# EAGLE schematic untitled (EAGLE 6.3)
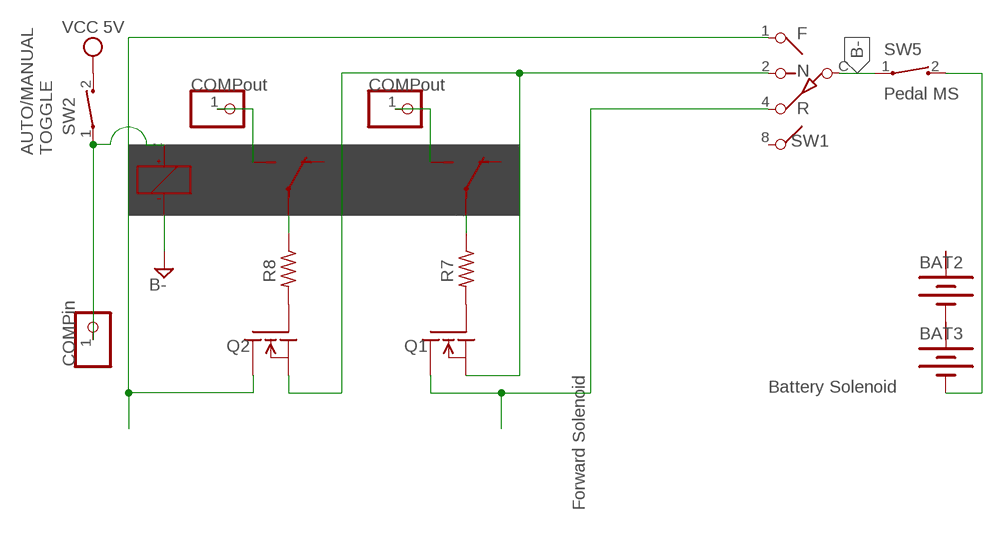
[diagram p0: schematic, sheet 1]

## Parts
BAT2  BATTERY  [BATTERY]
BAT3  BATTERY  [BATTERY]
JP4  COMPout  PINHD-1X1  [1X01]
JP6  COMPin  PINHD-1X1  [1X01]
JP22  COMPout  PINHD-1X1  [1X01]
K2  DF2-L-DC24V  [DF2]
Q1  BUZ11  [TO220]
Q2  BUZ11  [TO220]
R7  R-US_0204/5  [0204/5]
R8  R-US_0204/5  [0204/5]
SW1  SW-C10  [SW-C10]
SW2  Pedal MS  CT10-XXXX-A2  [CT10-XXXX-A2]
SW5  Pedal MS  CT10-XXXX-A2  [CT10-XXXX-A2]

## Nets
B-: BAT3.- Q1.3(S) Q2.3(S) SW1.2 SW5.2
FGND: Q1.2(D) SW1.4
GND1: K2.1(1:-) ; supply symbol labelled B-
N$1: JP4.1 K2.6(2:S)
N$2: JP22.1 K2.7(3:S)
N$7: BAT2.- BAT3.+
N$10: K2.10(3:P) R7.1
N$11: Q2.1(G) R8.2
N$12: Q1.1(G) R7.2
N$13: K2.3(2:P) R8.1
N$23: JP6.1 K2.12(1:+) SW2.1
N$97: SW1.C SW5.1
RGND: Q2.2(D) SW1.1
VCC: SW2.2 ; supply symbol labelled VCC 5V
Unconnected: K2.5(2:O) K2.8(3:O) SW1.8

## Notes on the sheet
- F
  
  N
  
  R
- AUTO/MANUAL
  TOGGLE
- Forward Solenoid
- Battery Solenoid

## Power pins joined to a net without a drawn wire
+: BAT2.+ BAT2.+@1(+) BAT3.+@1(+)

## Library data of the parts
BAT2 BAT3 = special:BATTERY: BATTERY
JP4 JP6 JP22 = adafruit:PINHD-1X1: Pin header 1x1 for 0.1" spacing With round pins
K2 = relay:DF2-?DC*: HIGHLY SENSITIVE DIP MINIATURE RELAY NAiS Single side stable / 1 coil latching Source: http://www.mew-europe.com/.. en_ds_61002_0000.pdf; OC_FARNELL: unknown; OC_NEWARK: unknown
Q1 Q2 = transistor-fet:BUZ11: N-Channel Enhancement MOSFET 50V; 30A; 0,040Ohm
R7 R8 = rcl:R-US_: RESISTOR, American symbol
SW1 = special:SW-C10: SWITCH 10-step rotary switch
SW2 SW5 = switch-coto:CT10-XXXX-: CT10 Series Molded Switch Source: www.cotorelay.com .. Coto_Technology__CT10-1530-G1.pdf